# Altium schematic sheet Punto DC.SchDoc
size Letter
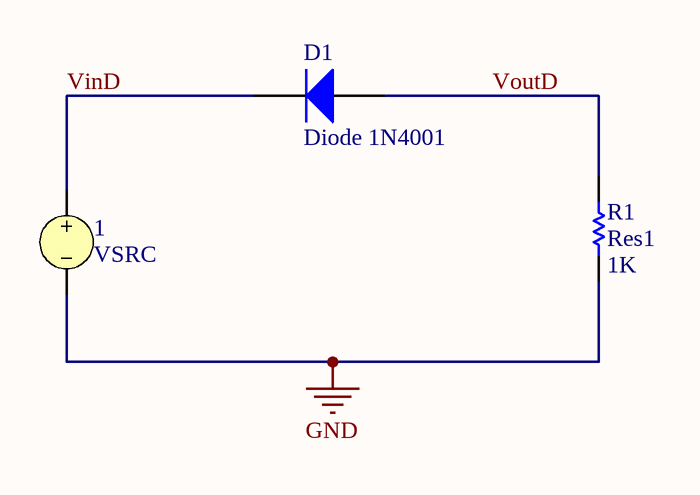
[diagram p0: Punto DC.SchDoc]

## Parts
1  VSRC
D1  Diode 1N4001  [DO-41]
R1  Res1  value 1K  [AXIAL-0.3]

## Nets
GND: 1.2 R1.1
VinD: 1.1 D1.2(K)
VoutD: D1.1(A) R1.2

## Notes on the sheet
- Project:
- Page content:
- Size:
- Revisión
- Letter
- Document Number
- Design:
- Date:
- Sheet:
- of

## Library data of the parts
1 = VSRC: Voltage Source; Note: PCB Footprint - Not required; Value: +5; Published: 8-Jun-2000; LatestRevisionDate: 17-Jul-2002; LatestRevisionNote: Re-released for DXP Platform.; PackageReference: Not Applicable; Publisher: Altium Limited
D1 = Diode 1N4001: 1 Amp General Purpose Rectifier; Published: 8-Jun-2000; LatestRevisionDate: 17-Jul-2002; LatestRevisionNote: Re-released for DXP Platform.; DatasheetVersion: 1998; PackageVersion: Aug-1999; PackageReference: DO-41; Publisher: Altium Limited; PackageDescription: Diode, Axial; Body 5.2 x 2.7 mm (LxDia. max), Lead Dia. 0.86 mm (max); Code_JEDEC: DO-204-AL; ComponentLink1Description: Manufacturer Link; ComponentLink1URL: http://www.fairchildsemi.com/; ComponentLink2Description: Datasheet; ComponentLink2URL: http://www.fairchildsemi.com/ds/1N%2F1N4001.pdf
R1 = Res1: Resistor; Published: 8-Jun-2000; LatestRevisionDate: 17-Jul-2002; LatestRevisionNote: Re-released for DXP Platform.; PackageReference: AXIAL-0.3; Publisher: Altium Limited; PackageDescription: Axial Device, Thru-Hole; 2 Leads; 0.3 in Pin Spacing